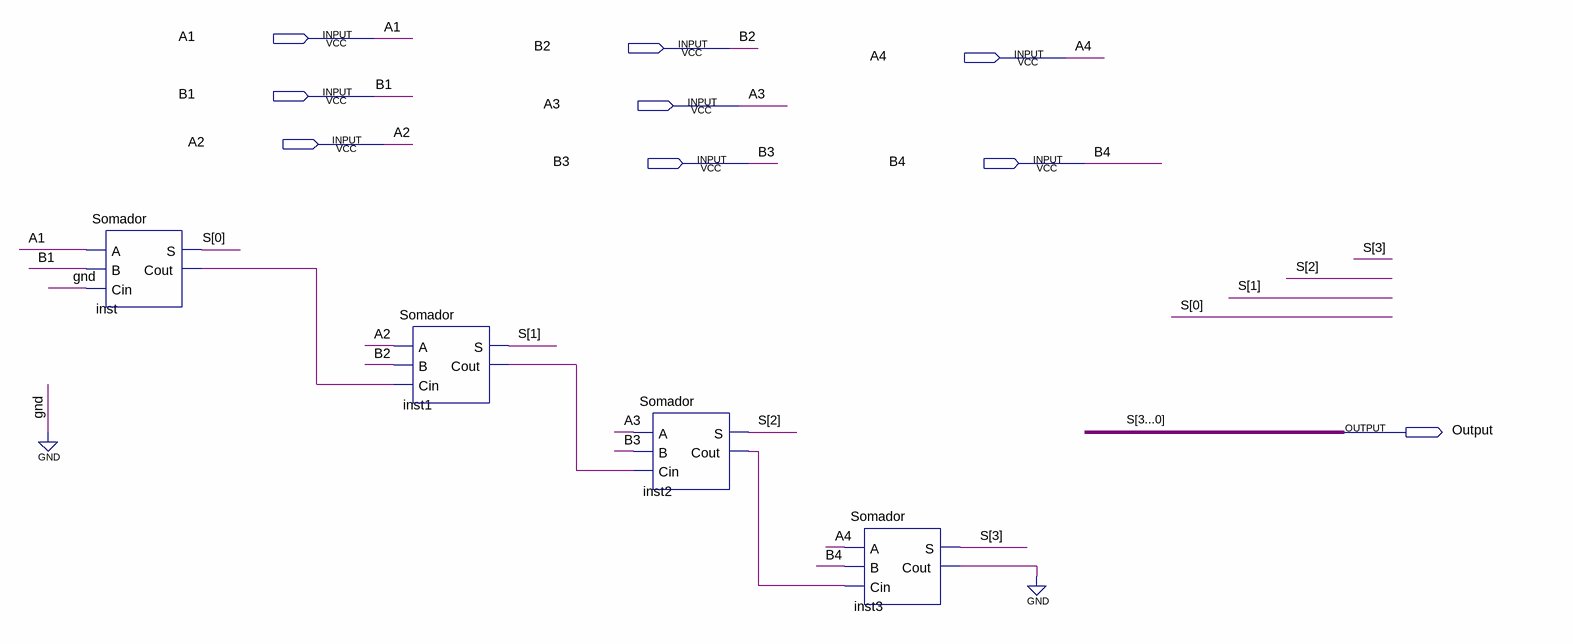
[diagram p0: schematic sheet]
// Quartus schematic somadorcompleto4bits.bdf as structural Verilog: 4 symbols, 9 pins
module somadorcompleto4bits (
  input  A1,
  input  B2,
  input  A4,
  input  B1,
  input  A3,
  input  A2,
  input  B3,
  input  B4,
  output Output
);

  wire inst1_cout, inst2_cout, inst3_cout, inst_cout;
  wire [3:0] S;

  Somador inst (.A(A1), .B(B1), .Cin(1'b0), .S(S[0]), .Cout(inst_cout));
  Somador inst1 (.A(A2), .B(B2), .Cin(inst_cout), .S(S[1]), .Cout(inst1_cout));
  Somador inst2 (.A(A3), .B(B3), .Cin(inst1_cout), .S(S[2]), .Cout(inst2_cout));
  Somador inst3 (.A(A4), .B(B4), .Cin(inst2_cout), .S(S[3]), .Cout(inst3_cout));
  // also tied to GND on the sheet: inst3_cout

  // Other names for the same wires on the sheet: S[3...0] = Output
endmodule
